# Altium schematic sheet Top_Sheet.SchDoc
size A3; SheetNumber: 1; SheetTotal: 10
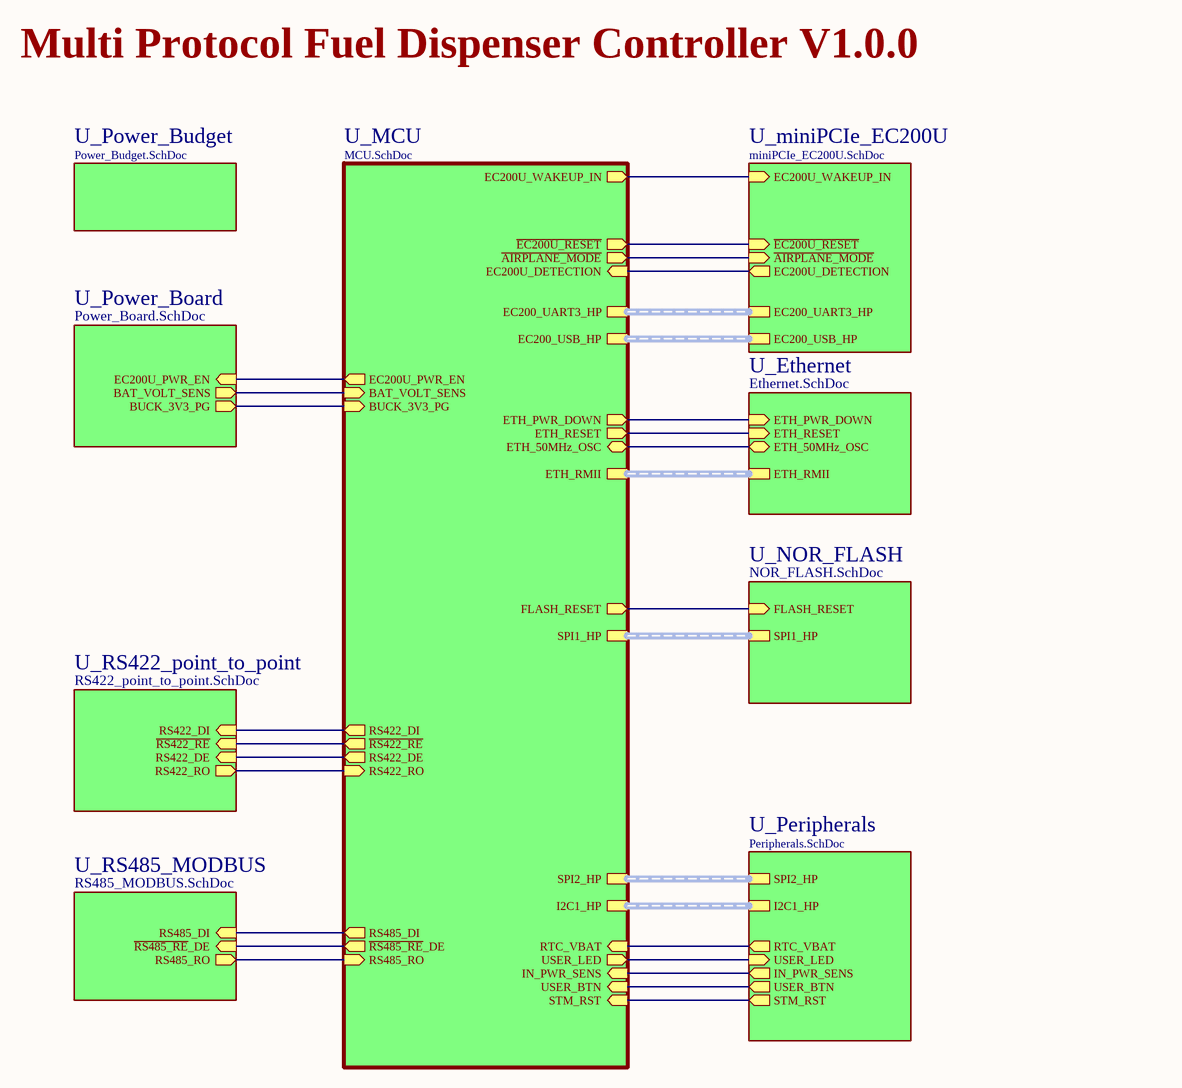
[diagram p0: Top_Sheet.SchDoc]

## Sub-sheets
U_Ethernet = Ethernet.SchDoc: ETH_RMII (harness ETH_RMII), ETH_50MHz_OSC (bidir), ETH_RESET (in), ETH_PWR_DOWN (in)
U_MCU = MCU.SchDoc: EC200U_WAKEUP_IN (out), ~{EC200U_RESET} (out), ~{AIRPLANE_MODE} (out), EC200U_DETECTION (in), SPI1_HP (harness SPI1), I2C1_HP (harness I2C1), EC200_USB_HP (harness EC200_USB), SPI2_HP (harness SPI2_uSD), EC200U_PWR_EN (out), STM_RST (in), RTC_VBAT (in), IN_PWR_SENS (in), USER_LED (out), USER_BTN (in), ETH_50MHz_OSC (bidir), ETH_RESET (out), EC200_UART3_HP (harness EC200_UART3), BAT_VOLT_SENS (in), ETH_RMII (harness ETH_RMII), RS485_RO (in), RS485_DI (out), ~{RS485_RE}_DE (out), RS422_RO (in), RS422_DI (out), ~{RS422_RE} (out), RS422_DE (out), BUCK_3V3_PG (in), FLASH_RESET (out), ETH_PWR_DOWN (out)
U_miniPCIe_EC200U = miniPCIe_EC200U.SchDoc: EC200_USB_HP (harness EC200_USB), EC200U_DETECTION (out), ~{AIRPLANE_MODE} (in), EC200_UART3_HP (harness EC200_UART3), ~{EC200U_RESET} (in), EC200U_WAKEUP_IN (in)
U_NOR_FLASH = NOR_FLASH.SchDoc: SPI1_HP (harness SPI1), FLASH_RESET (in)
U_Peripherals = Peripherals.SchDoc: I2C1_HP (harness I2C1), USER_LED (in), IN_PWR_SENS (out), USER_BTN (out), STM_RST (out), RTC_VBAT (out), SPI2_HP (harness SPI2_uSD)
U_Power_Board = Power_Board.SchDoc: BAT_VOLT_SENS (out), BUCK_3V3_PG (out), EC200U_PWR_EN (in)
U_Power_Budget = Power_Budget.SchDoc: no entries
U_RS422_point_to_point = RS422_point_to_point.SchDoc: RS422_DI (in), ~{RS422_RE} (in), RS422_DE (in), RS422_RO (out)
U_RS485_MODBUS = RS485_MODBUS.SchDoc: RS485_DI (in), ~{RS485_RE}_DE (in), RS485_RO (out)

## Nets
(unnamed): sheet U_MCU/EC200U_WAKEUP_IN, sheet U_miniPCIe_EC200U/EC200U_WAKEUP_IN
(unnamed): sheet U_MCU/~{EC200U_RESET}, sheet U_miniPCIe_EC200U/~{EC200U_RESET}
(unnamed): sheet U_MCU/~{AIRPLANE_MODE}, sheet U_miniPCIe_EC200U/~{AIRPLANE_MODE}
(unnamed): sheet U_MCU/EC200U_DETECTION, sheet U_miniPCIe_EC200U/EC200U_DETECTION
(unnamed): sheet U_MCU/EC200U_PWR_EN, sheet U_Power_Board/EC200U_PWR_EN
(unnamed): sheet U_MCU/STM_RST, sheet U_Peripherals/STM_RST
(unnamed): sheet U_MCU/RTC_VBAT, sheet U_Peripherals/RTC_VBAT
(unnamed): sheet U_MCU/IN_PWR_SENS, sheet U_Peripherals/IN_PWR_SENS
(unnamed): sheet U_MCU/USER_LED, sheet U_Peripherals/USER_LED
(unnamed): sheet U_MCU/USER_BTN, sheet U_Peripherals/USER_BTN
(unnamed): sheet U_MCU/ETH_50MHz_OSC, sheet U_Ethernet/ETH_50MHz_OSC
(unnamed): sheet U_MCU/ETH_RESET, sheet U_Ethernet/ETH_RESET
(unnamed): sheet U_MCU/BAT_VOLT_SENS, sheet U_Power_Board/BAT_VOLT_SENS
(unnamed): sheet U_MCU/RS485_RO, sheet U_RS485_MODBUS/RS485_RO
(unnamed): sheet U_MCU/RS485_DI, sheet U_RS485_MODBUS/RS485_DI
(unnamed): sheet U_MCU/~{RS485_RE}_DE, sheet U_RS485_MODBUS/~{RS485_RE}_DE
(unnamed): sheet U_MCU/RS422_RO, sheet U_RS422_point_to_point/RS422_RO
(unnamed): sheet U_MCU/RS422_DI, sheet U_RS422_point_to_point/RS422_DI
(unnamed): sheet U_MCU/~{RS422_RE}, sheet U_RS422_point_to_point/~{RS422_RE}
(unnamed): sheet U_MCU/RS422_DE, sheet U_RS422_point_to_point/RS422_DE
(unnamed): sheet U_MCU/BUCK_3V3_PG, sheet U_Power_Board/BUCK_3V3_PG
(unnamed): sheet U_MCU/FLASH_RESET, sheet U_NOR_FLASH/FLASH_RESET
(unnamed): sheet U_MCU/ETH_PWR_DOWN, sheet U_Ethernet/ETH_PWR_DOWN

## Buses and harness runs
harness sheet U_Ethernet/ETH_RMII = sheet U_MCU/ETH_RMII
harness sheet U_MCU/EC200_UART3_HP = sheet U_miniPCIe_EC200U/EC200_UART3_HP
harness sheet U_MCU/EC200_USB_HP = sheet U_miniPCIe_EC200U/EC200_USB_HP
harness sheet U_MCU/I2C1_HP = sheet U_Peripherals/I2C1_HP
harness sheet U_MCU/SPI1_HP = sheet U_NOR_FLASH/SPI1_HP
harness sheet U_MCU/SPI2_HP = sheet U_Peripherals/SPI2_HP

## Notes on the sheet
- Multi Protocol Fuel Dispenser Controller V1.0.0